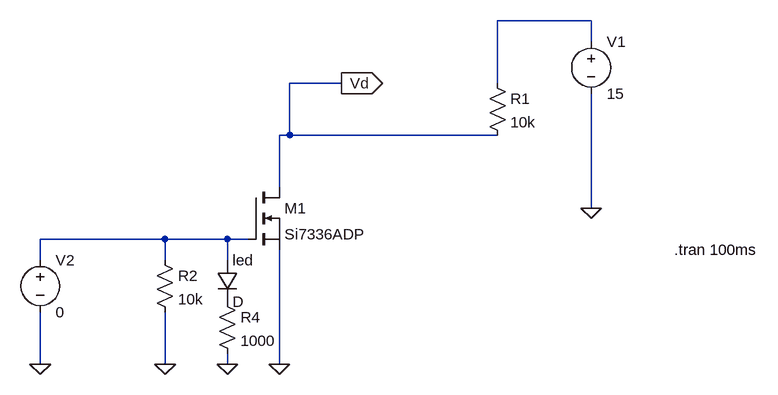
[diagram p0: schematic PTT_Mosfet.asc]
PTT_Mosfet.asc, the LTspice schematic file:
Version 4
SHEET 1 1040 680
WIRE 768 -160 624 -160
WIRE 768 -128 768 -160
WIRE 384 -64 304 -64
WIRE 624 -64 624 -160
WIRE 304 16 304 -64
WIRE 304 16 288 16
WIRE 624 16 304 16
WIRE 288 96 288 16
WIRE 768 128 768 -48
WIRE 112 176 -80 176
WIRE 208 176 112 176
WIRE 240 176 208 176
WIRE -80 208 -80 176
WIRE 112 208 112 176
WIRE 208 208 208 176
WIRE -80 368 -80 288
WIRE 112 368 112 288
WIRE 208 368 208 352
WIRE 288 368 288 192
FLAG 768 128 0
FLAG -80 368 0
FLAG 112 368 0
FLAG 288 368 0
FLAG 208 368 0
FLAG 384 -64 Vd
IOPIN 384 -64 Out
SYMBOL nmos 240 96 R0
SYMATTR InstName M1
SYMATTR Value Si7336ADP
SYMBOL res 608 -80 R0
SYMATTR InstName R1
SYMATTR Value 10k
SYMBOL voltage 768 -144 R0
WINDOW 123 0 0 Left 0
WINDOW 39 0 0 Left 0
SYMATTR InstName V1
SYMATTR Value 15
SYMBOL voltage -80 192 R0
WINDOW 123 0 0 Left 0
WINDOW 39 0 0 Left 0
SYMATTR InstName V2
SYMATTR Value 0
SYMBOL res 96 192 R0
SYMATTR InstName R2
SYMATTR Value 10k
SYMBOL diode 192 208 R0
SYMATTR InstName led
SYMBOL res 192 256 R0
SYMATTR InstName R4
SYMATTR Value 1000
TEXT 896 192 Left 2 !.tran 100ms

The netlist it stands for:
* PTT_Mosfet.asc
M1 Vd N002 0 0 Si7336ADP
R1 N001 Vd 10k
V1 N001 0 15
V2 N002 0 0
R2 N002 0 10k
D§led N002 P001 D
R4 P001 0 1000
.model D D
.lib standard.dio
.model NMOS NMOS
.model PMOS PMOS
.lib standard.mos
.tran 100ms
.backanno
.end